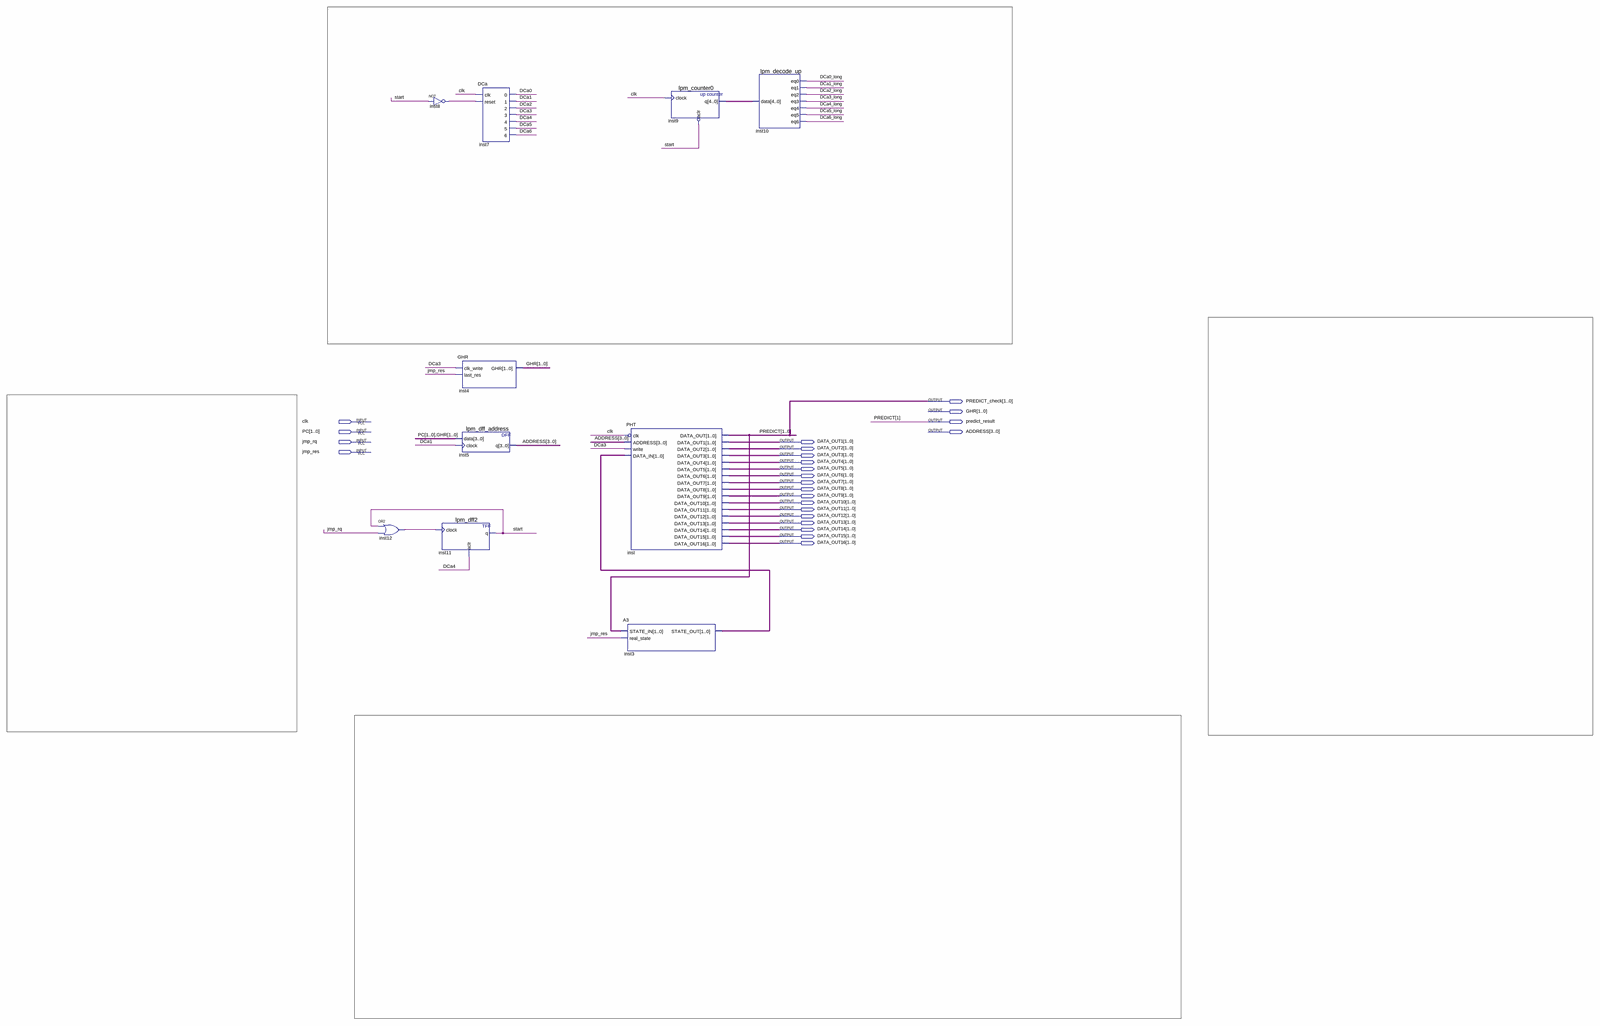
[diagram p0: schematic sheet, whole]
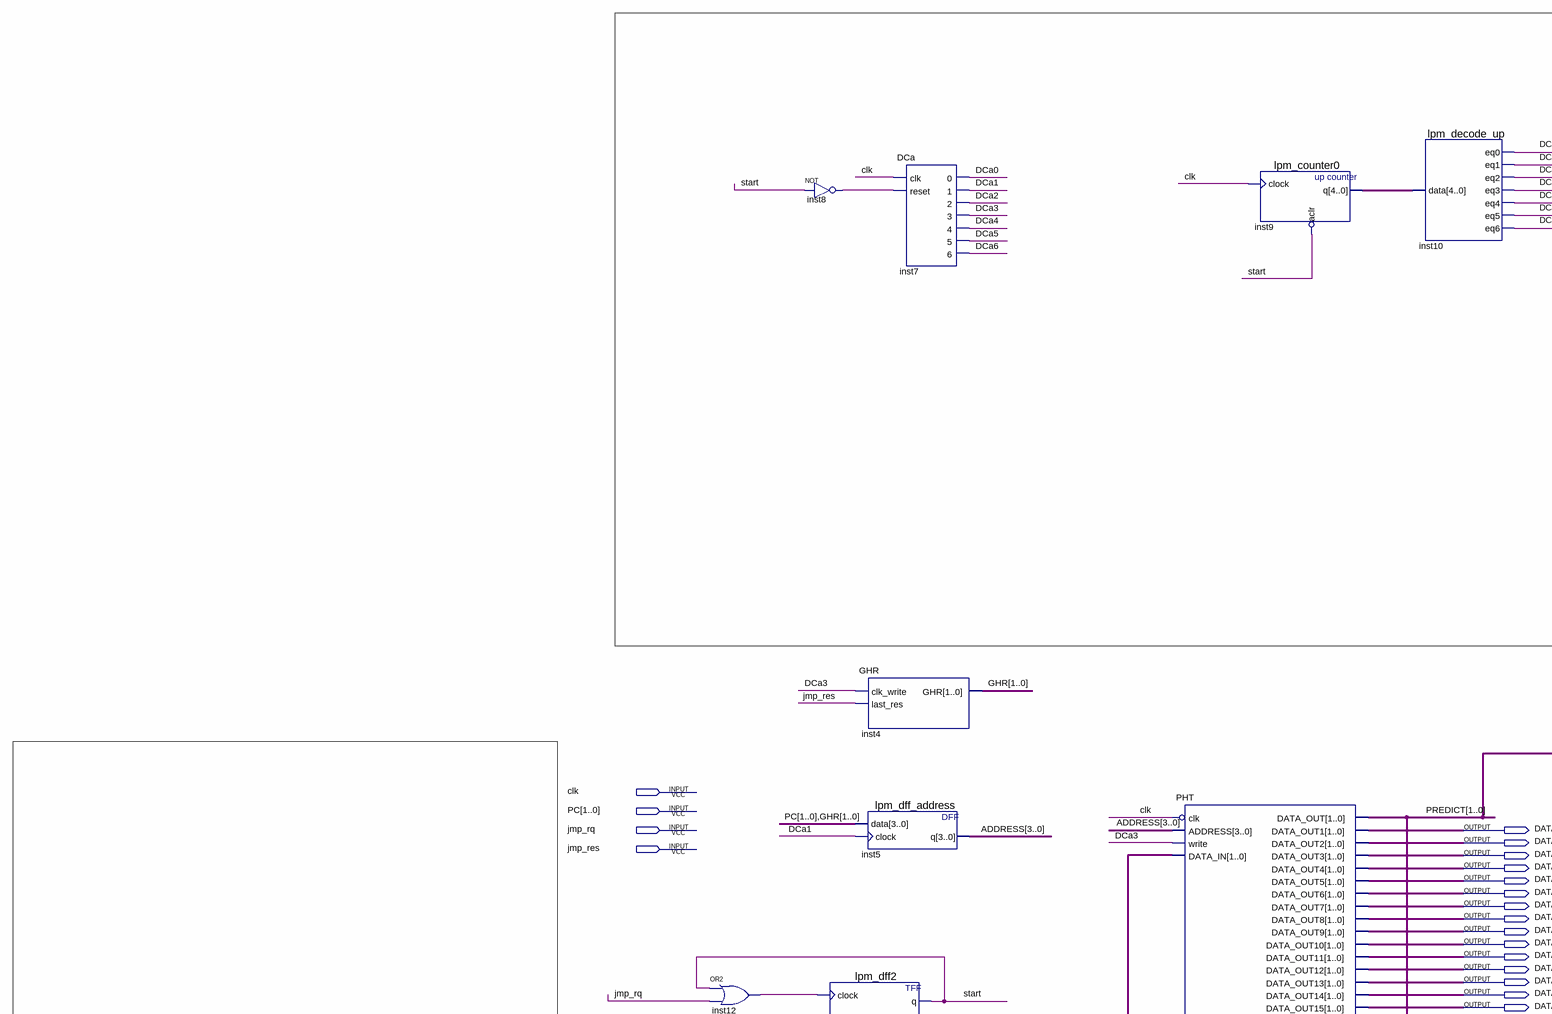
[diagram p1: schematic sheet, upper left part]
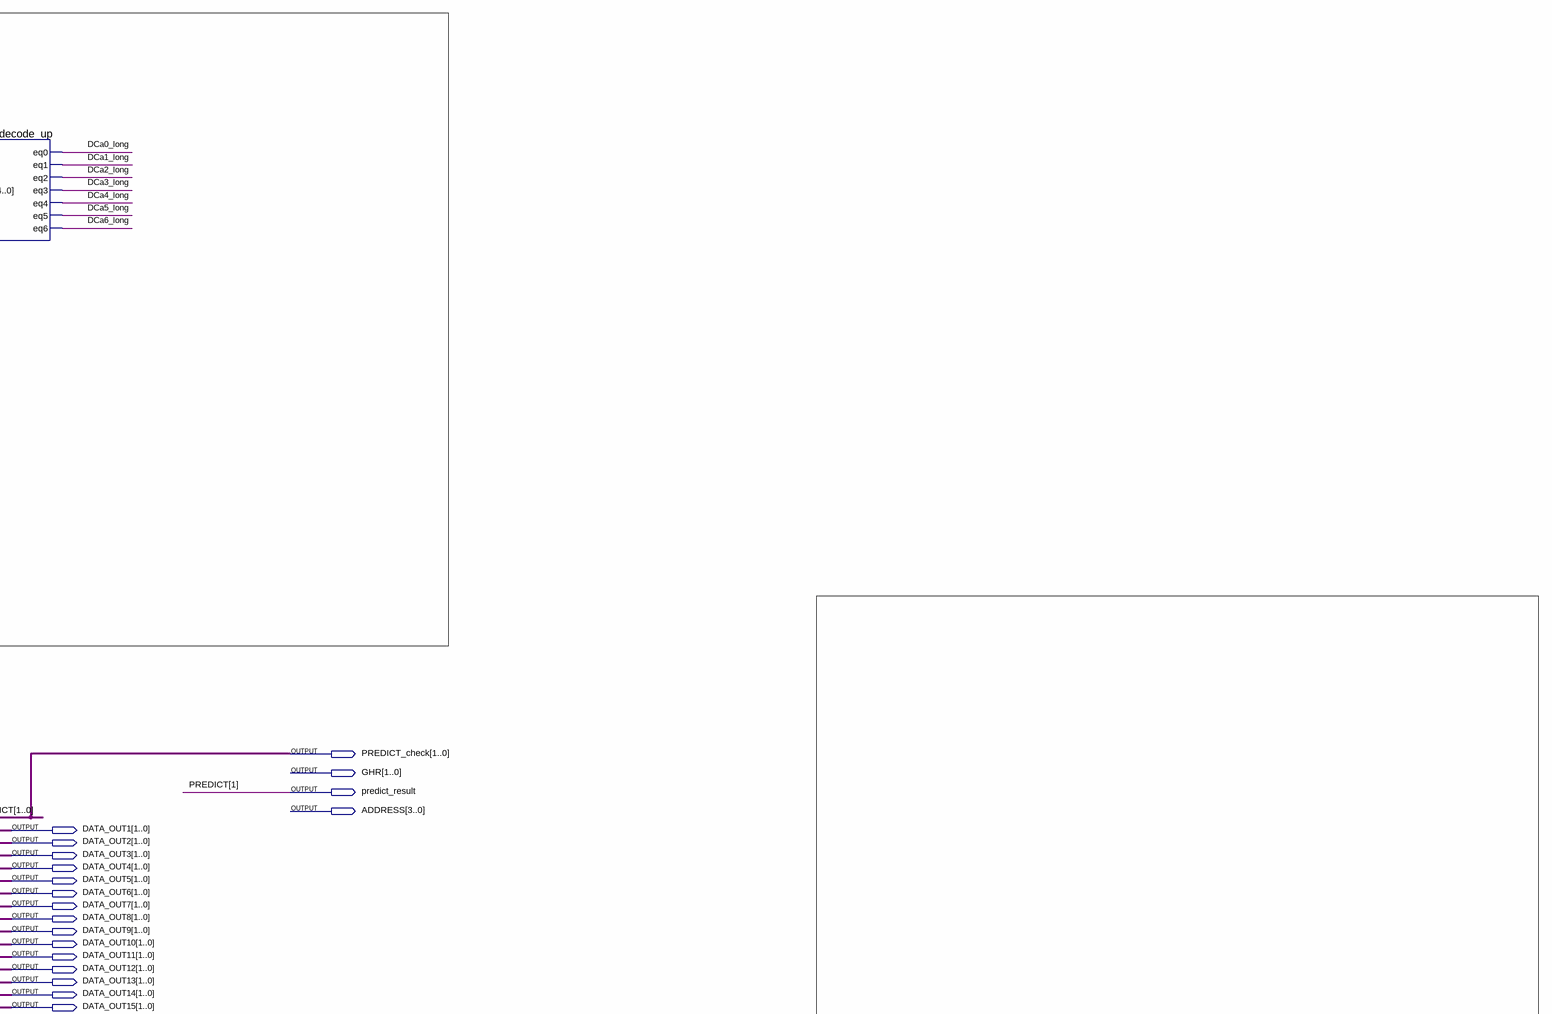
[diagram p2: schematic sheet, upper right part]
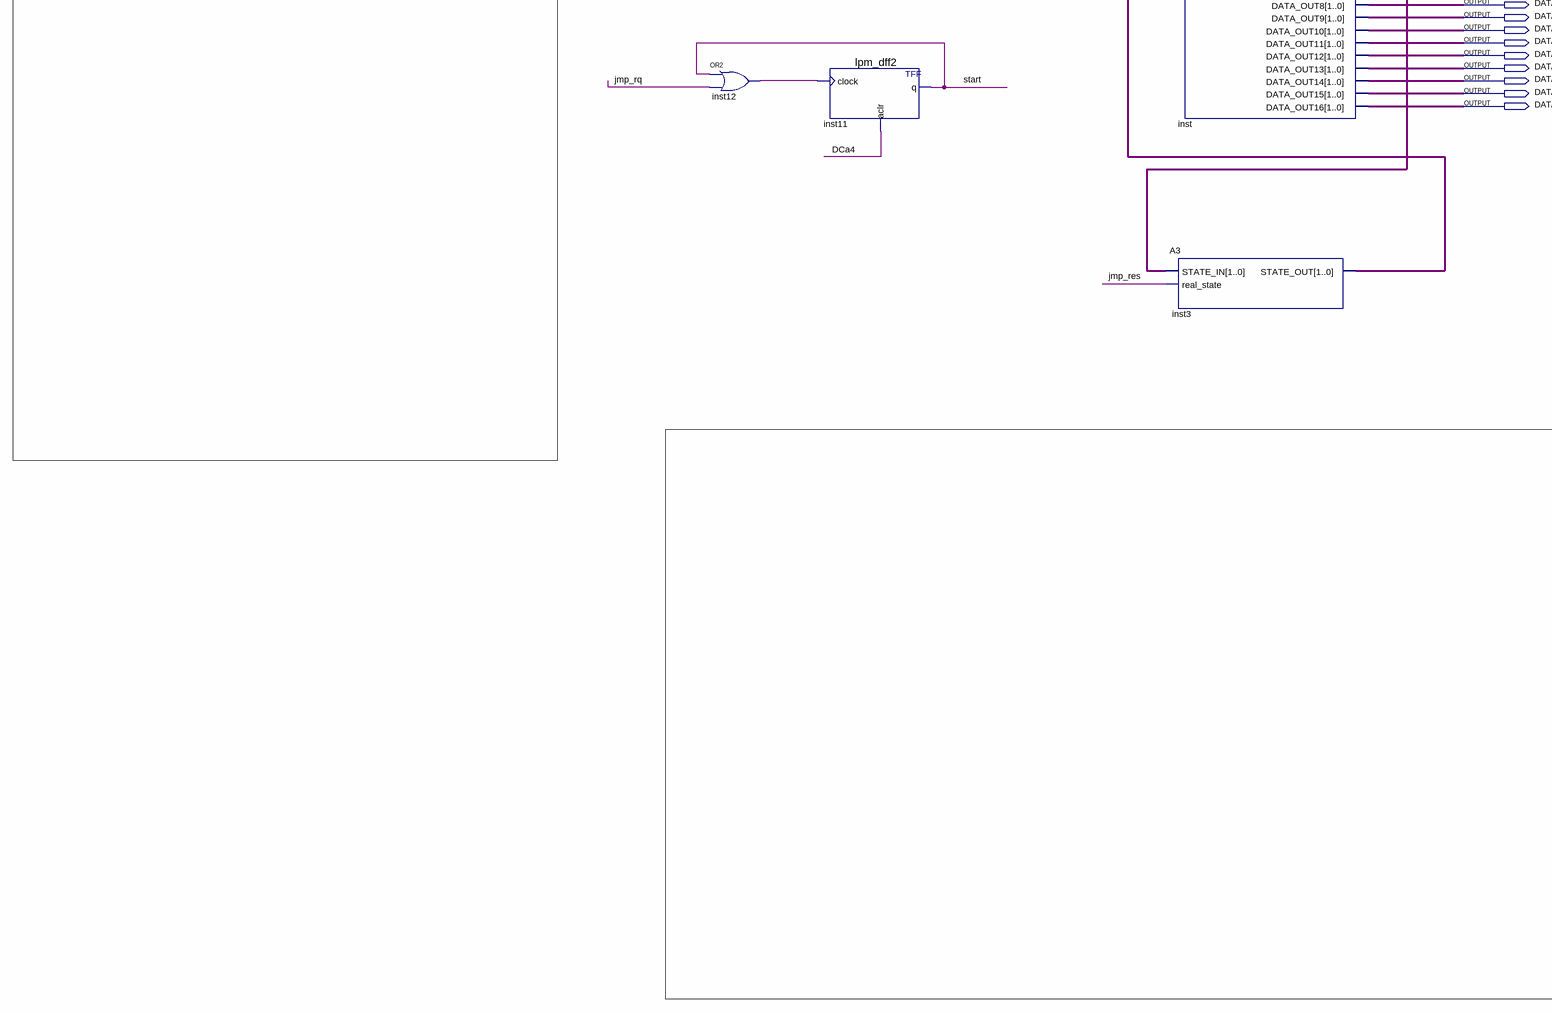
[diagram p3: schematic sheet, lower left part]
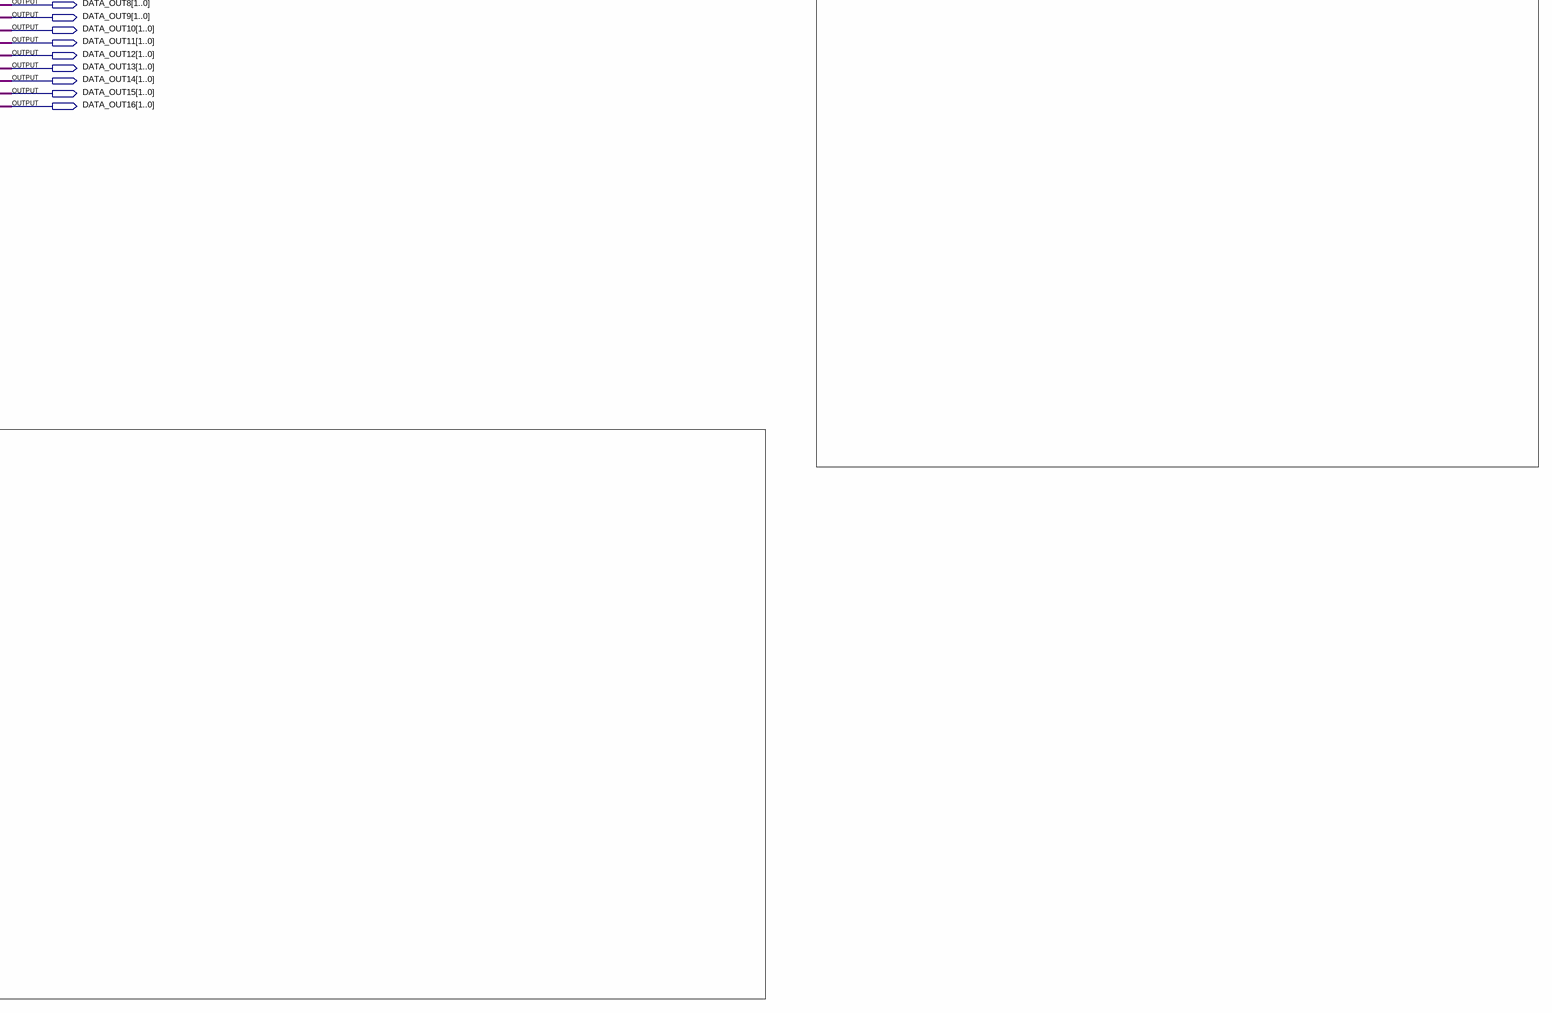
[diagram p4: schematic sheet, lower right part]
// Quartus schematic result.bdf as structural Verilog: 10 symbols, 24 pins
module result (
  input  clk,
  input  [1:0] PC,
  input  jmp_rq,
  input  jmp_res,
  output [1:0] PREDICT_check,
  output [1:0] GHR,
  output predict_result,
  output [3:0] ADDRESS,
  output [1:0] DATA_OUT1,
  output [1:0] DATA_OUT2,
  output [1:0] DATA_OUT3,
  output [1:0] DATA_OUT4,
  output [1:0] DATA_OUT5,
  output [1:0] DATA_OUT6,
  output [1:0] DATA_OUT7,
  output [1:0] DATA_OUT8,
  output [1:0] DATA_OUT9,
  output [1:0] DATA_OUT10,
  output [1:0] DATA_OUT11,
  output [1:0] DATA_OUT12,
  output [1:0] DATA_OUT13,
  output [1:0] DATA_OUT14,
  output [1:0] DATA_OUT15,
  output [1:0] DATA_OUT16
);

  wire DCa0, DCa0_long, DCa1, DCa1_long, DCa2, DCa2_long, DCa3, DCa3_long, DCa4, DCa4_long, DCa5, DCa5_long,
       DCa6, DCa6_long, inst8_out, inst12_out, start;
  wire [1:0] inst3_state_out;
  wire [4:0] inst9_q;

  or inst12 (inst12_out, start, jmp_rq);
  not inst8 (inst8_out, start);
  GHR inst4 (.clk_write(DCa3), .last_res(jmp_res), .GHR(GHR));
  lpm_dff_address inst5 (.data({PC, GHR}), .clock(DCa1), .q(ADDRESS));
  lpm_dff2 inst11 (.clock(inst12_out), .aclr(DCa4), .q(start));
  DCa inst7 (
    .clk(clk), .reset(inst8_out), .\0 (DCa0), .\1 (DCa1), .\2 (DCa2), .\3 (DCa3), .\4 (DCa4), .\5 (DCa5),
    .\6 (DCa6));
  A3 inst3 (.STATE_IN(PREDICT_check), .real_state(jmp_res), .STATE_OUT(inst3_state_out));
  PHT inst (
    .clk(~clk), .ADDRESS(ADDRESS), .write(DCa3), .DATA_IN(inst3_state_out), .DATA_OUT(PREDICT_check),
    .DATA_OUT1(DATA_OUT1), .DATA_OUT2(DATA_OUT2), .DATA_OUT3(DATA_OUT3), .DATA_OUT4(DATA_OUT4),
    .DATA_OUT5(DATA_OUT5), .DATA_OUT6(DATA_OUT6), .DATA_OUT7(DATA_OUT7), .DATA_OUT8(DATA_OUT8),
    .DATA_OUT9(DATA_OUT9), .DATA_OUT10(DATA_OUT10), .DATA_OUT11(DATA_OUT11), .DATA_OUT12(DATA_OUT12),
    .DATA_OUT13(DATA_OUT13), .DATA_OUT14(DATA_OUT14), .DATA_OUT15(DATA_OUT15), .DATA_OUT16(DATA_OUT16));
  lpm_counter0 inst9 (.clock(clk), .aclr(~start), .q(inst9_q));
  lpm_decode_up inst10 (
    .data(inst9_q), .eq0(DCa0_long), .eq1(DCa1_long), .eq2(DCa2_long), .eq3(DCa3_long), .eq4(DCa4_long),
    .eq5(DCa5_long), .eq6(DCa6_long));

  assign predict_result = PREDICT_check[1];

  // Other names for the same wires on the sheet: PREDICT[1:0] = PREDICT_check
endmodule
